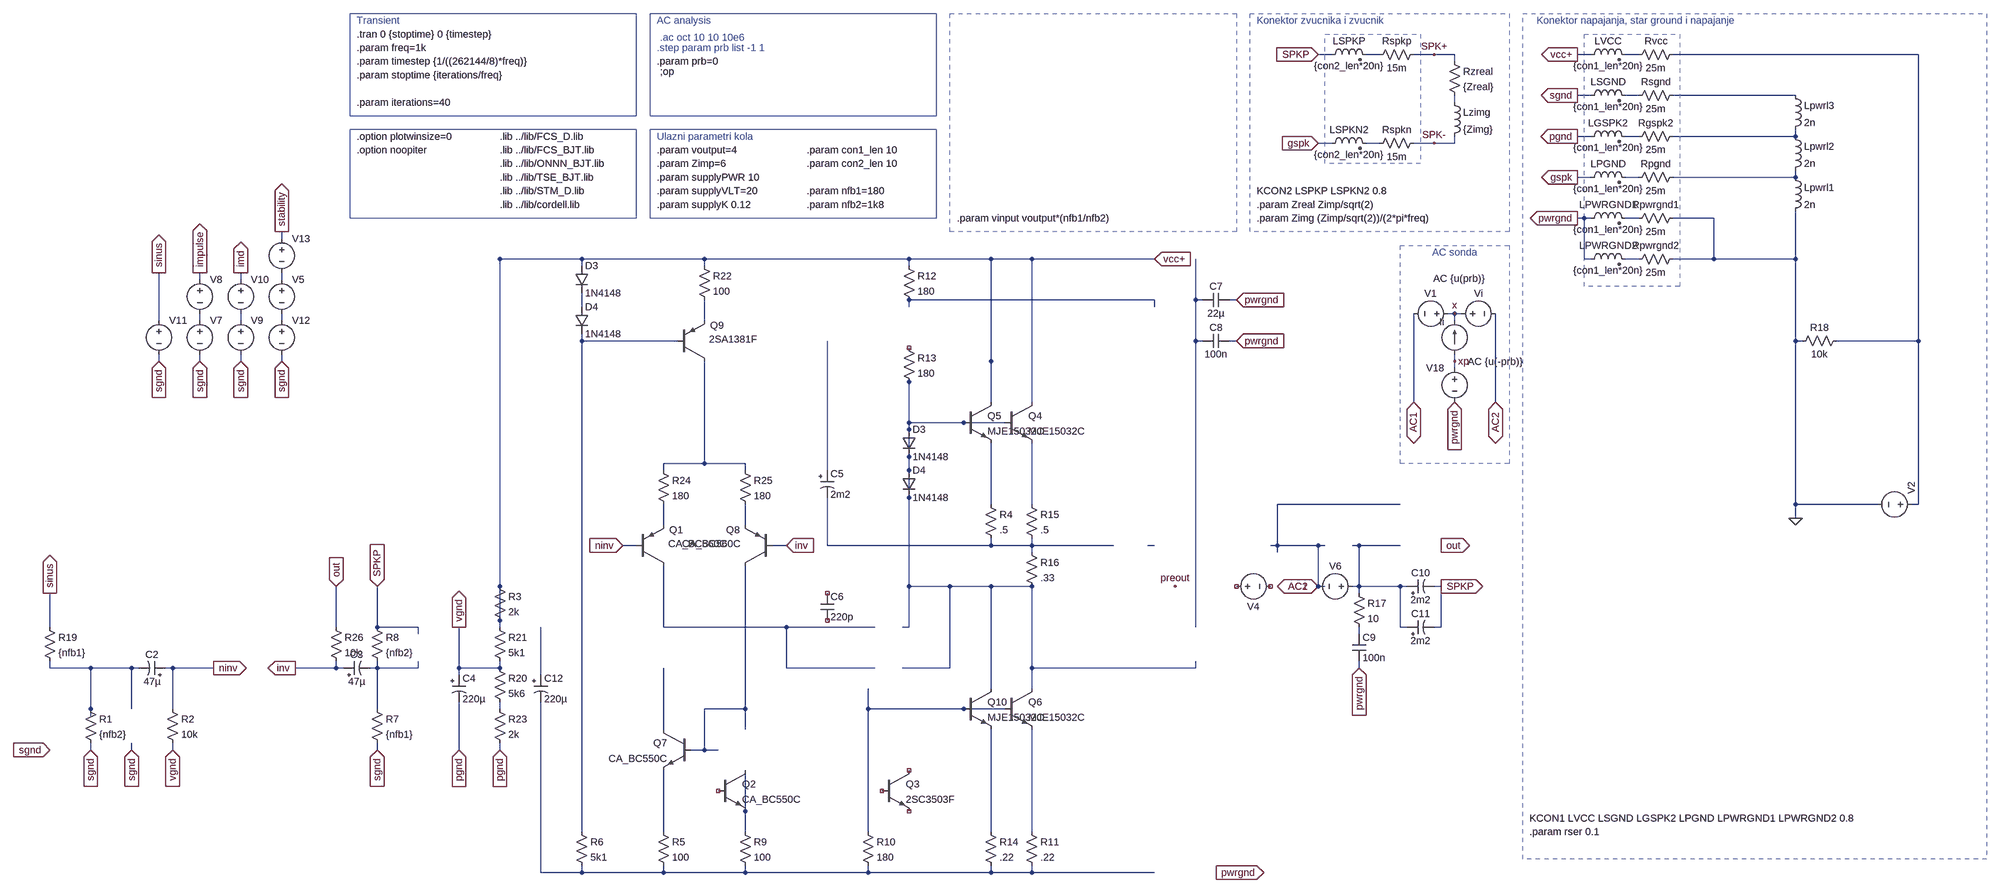
[diagram p0: schematic pa2bb-sewo.asc]
pa2bb-sewo.asc, the LTspice schematic file:
Version 4
SHEET 1 6124 2336
WIRE 2272 -1536 2240 -1536
WIRE 2384 -1536 2352 -1536
WIRE 2512 -1536 2464 -1536
WIRE 2560 -1536 2512 -1536
WIRE 2880 -1536 2848 -1536
WIRE 2992 -1536 2960 -1536
WIRE 3648 -1536 3072 -1536
WIRE 2560 -1520 2560 -1536
WIRE 2880 -1440 2848 -1440
WIRE 2992 -1440 2960 -1440
WIRE 3360 -1440 3072 -1440
WIRE 2560 -1424 2560 -1440
WIRE 2880 -1344 2848 -1344
WIRE 2992 -1344 2960 -1344
WIRE 3360 -1344 3360 -1360
WIRE 3360 -1344 3072 -1344
WIRE 2272 -1328 2240 -1328
WIRE 2384 -1328 2352 -1328
WIRE 2512 -1328 2464 -1328
WIRE 2560 -1328 2560 -1344
WIRE 2560 -1328 2512 -1328
WIRE 2880 -1248 2848 -1248
WIRE 2992 -1248 2960 -1248
WIRE 3360 -1248 3360 -1264
WIRE 3360 -1248 3072 -1248
WIRE 2864 -1152 2848 -1152
WIRE 2880 -1152 2864 -1152
WIRE 2992 -1152 2960 -1152
WIRE 3168 -1152 3072 -1152
WIRE -192 -1104 -192 -1120
WIRE 416 -1056 320 -1056
WIRE 512 -1056 416 -1056
WIRE 800 -1056 512 -1056
WIRE 1184 -1056 800 -1056
WIRE 1280 -1056 1184 -1056
WIRE 1472 -1056 1280 -1056
WIRE 1568 -1056 1472 -1056
WIRE 1760 -1056 1568 -1056
WIRE 1856 -1056 1760 -1056
WIRE 2864 -1056 2864 -1152
WIRE 2880 -1056 2864 -1056
WIRE 2992 -1056 2960 -1056
WIRE 3168 -1056 3168 -1152
WIRE 3168 -1056 3072 -1056
WIRE 3360 -1056 3360 -1168
WIRE 3360 -1056 3168 -1056
WIRE 512 -1040 512 -1056
WIRE 800 -1040 800 -1056
WIRE 1280 -1040 1280 -1056
WIRE -384 -1008 -384 -1024
WIRE -288 -1008 -288 -1024
WIRE -192 -1008 -192 -1024
WIRE 1856 -960 1280 -960
WIRE 1952 -960 1952 -1056
WIRE 1968 -960 1952 -960
WIRE 2048 -960 2032 -960
WIRE 512 -944 512 -976
WIRE 1280 -944 1280 -960
WIRE 1856 -944 1856 -960
WIRE 2560 -928 2544 -928
WIRE 2576 -928 2560 -928
WIRE -480 -912 -480 -1024
WIRE -384 -912 -384 -928
WIRE -288 -912 -288 -928
WIRE -192 -912 -192 -928
WIRE 800 -912 800 -960
WIRE 2560 -912 2560 -928
WIRE 512 -864 512 -880
WIRE 736 -864 512 -864
WIRE 1952 -864 1952 -960
WIRE 1968 -864 1952 -864
WIRE 2048 -864 2032 -864
WIRE 3360 -864 3360 -1056
WIRE 3376 -864 3360 -864
WIRE 3648 -864 3648 -1536
WIRE 3648 -864 3456 -864
WIRE -480 -816 -480 -832
WIRE -384 -816 -384 -832
WIRE -288 -816 -288 -832
WIRE -192 -816 -192 -832
WIRE 1472 -816 1472 -1056
WIRE 2560 -816 2560 -832
WIRE 2560 -800 2560 -816
WIRE 1472 -720 1472 -1056
WIRE 1568 -720 1568 -1056
WIRE 2464 -720 2464 -928
WIRE 2656 -720 2656 -928
WIRE 1280 -672 1280 -768
WIRE 1408 -672 1280 -672
WIRE 1504 -672 1408 -672
WIRE 1280 -656 1280 -672
WIRE 800 -576 800 -816
WIRE 800 -576 704 -576
WIRE 896 -576 800 -576
WIRE 704 -560 704 -576
WIRE 896 -560 896 -576
WIRE 1088 -560 1088 -864
WIRE 1280 -560 1280 -592
WIRE 1472 -480 1472 -624
WIRE 1568 -480 1568 -624
WIRE 2432 -480 2144 -480
WIRE 3360 -480 3360 -864
WIRE 3552 -480 3360 -480
WIRE 3648 -480 3648 -864
WIRE 3648 -480 3632 -480
WIRE 3360 -448 3360 -480
WIRE 704 -432 704 -480
WIRE 896 -432 896 -480
WIRE 640 -384 608 -384
WIRE 992 -384 960 -384
WIRE 1088 -384 1088 -496
WIRE 1360 -384 1088 -384
WIRE 1472 -384 1472 -400
WIRE 1472 -384 1360 -384
WIRE 1568 -384 1568 -400
WIRE 1568 -384 1472 -384
WIRE 1760 -384 1568 -384
WIRE 1856 -384 1840 -384
WIRE 2144 -384 2144 -480
WIRE 2144 -384 2128 -384
WIRE 2240 -384 2144 -384
WIRE 2256 -384 2240 -384
WIRE 2336 -384 2320 -384
WIRE 2432 -384 2336 -384
WIRE 1568 -368 1568 -384
WIRE 2144 -368 2144 -384
WIRE 320 -288 320 -1056
WIRE 1280 -288 1280 -496
WIRE 1472 -288 1280 -288
WIRE 1568 -288 1472 -288
WIRE 2240 -288 2240 -384
WIRE 2256 -288 2240 -288
WIRE 2336 -288 2336 -384
WIRE 2336 -288 2320 -288
WIRE 2432 -288 2336 -288
WIRE 2448 -288 2432 -288
WIRE 2528 -288 2512 -288
WIRE 2336 -272 2336 -288
WIRE -736 -192 -736 -272
WIRE -64 -192 -64 -288
WIRE 32 -192 32 -288
WIRE 128 -192 32 -192
WIRE 320 -192 320 -1056
WIRE 704 -192 704 -336
WIRE 992 -192 704 -192
WIRE 1200 -192 992 -192
WIRE 1280 -192 1280 -768
WIRE 1280 -192 1264 -192
WIRE 1952 -192 1952 -864
WIRE 2432 -192 2432 -288
WIRE 2448 -192 2432 -192
WIRE 2528 -192 2528 -288
WIRE 2528 -192 2512 -192
WIRE 128 -176 128 -192
WIRE 2336 -176 2336 -192
WIRE -736 -96 -736 -112
WIRE -640 -96 -736 -96
WIRE -544 -96 -640 -96
WIRE -528 -96 -544 -96
WIRE -448 -96 -464 -96
WIRE -352 -96 -448 -96
WIRE -64 -96 -64 -112
WIRE -64 -96 -160 -96
WIRE -48 -96 -64 -96
WIRE 32 -96 32 -112
WIRE 32 -96 16 -96
WIRE 128 -96 128 -112
WIRE 128 -96 32 -96
WIRE 224 -96 224 -192
WIRE 320 -96 320 -112
WIRE 320 -96 224 -96
WIRE 992 -96 992 -192
WIRE 1200 -96 992 -96
WIRE 1376 -96 1376 -288
WIRE 1376 -96 1264 -96
WIRE 1952 -96 1952 -112
WIRE 1952 -96 1568 -96
WIRE 2336 -96 2336 -112
WIRE 224 -80 224 -96
WIRE 416 -80 416 -192
WIRE 1472 -48 1472 -288
WIRE 1568 -48 1568 -288
WIRE -544 0 -544 -96
WIRE -448 0 -448 -96
WIRE 32 0 32 -96
WIRE 320 0 320 -16
WIRE 896 0 896 -336
WIRE 896 0 800 0
WIRE 1184 0 1184 -48
WIRE 1408 0 1184 0
WIRE 1504 0 1408 0
WIRE -640 16 -640 -96
WIRE 704 48 704 -96
WIRE 896 48 896 0
WIRE -640 96 -640 80
WIRE -544 96 -544 80
WIRE -448 96 -448 80
WIRE 32 96 32 80
WIRE 224 96 224 -16
WIRE 320 96 320 80
WIRE 800 96 800 0
WIRE 800 96 768 96
WIRE 832 96 800 96
WIRE 512 288 512 -864
WIRE 704 288 704 144
WIRE 896 288 896 144
WIRE 1184 288 1184 0
WIRE 1472 288 1472 48
WIRE 1568 288 1568 48
WIRE 416 384 416 -16
WIRE 512 384 512 368
WIRE 512 384 416 384
WIRE 704 384 704 368
WIRE 704 384 512 384
WIRE 896 384 896 368
WIRE 896 384 704 384
WIRE 1184 384 1184 368
WIRE 1184 384 896 384
WIRE 1472 384 1472 368
WIRE 1472 384 1184 384
WIRE 1568 384 1568 368
WIRE 1568 384 1472 384
WIRE 1856 384 1568 384
FLAG 1856 -1056 vcc+
IOPIN 1856 -1056 In
FLAG 2560 -928 x
FLAG 2528 -384 out
IOPIN 2528 -384 Out
FLAG 2560 -816 xp
FLAG 2336 -96 pwrgnd
IOPIN 2336 -96 In
FLAG -480 -816 sgnd
IOPIN -480 -816 In
FLAG -480 -1024 sinus
IOPIN -480 -1024 Out
FLAG 2848 -1536 vcc+
IOPIN 2848 -1536 Out
FLAG 2848 -1248 gspk
IOPIN 2848 -1248 Out
FLAG 2848 -1344 pgnd
IOPIN 2848 -1344 Out
FLAG 2848 -1440 sgnd
IOPIN 2848 -1440 Out
FLAG -64 -288 out
IOPIN -64 -288 In
FLAG 2528 -288 SPKP
IOPIN 2528 -288 Out
FLAG 2240 -1328 gspk
IOPIN 2240 -1328 In
FLAG 2240 -1536 SPKP
IOPIN 2240 -1536 In
FLAG 2848 -1152 pwrgnd
IOPIN 2848 -1152 Out
FLAG 3360 -448 0
FLAG 2464 -720 AC1
IOPIN 2464 -720 BiDir
FLAG 2656 -720 AC2
IOPIN 2656 -720 BiDir
FLAG 2144 -288 AC1
IOPIN 2144 -288 BiDir
FLAG 2240 -288 AC2
IOPIN 2240 -288 BiDir
FLAG 2560 -720 pwrgnd
IOPIN 2560 -720 In
FLAG 2512 -1536 SPK+
FLAG 2512 -1328 SPK-
FLAG -288 -1024 imd
IOPIN -288 -1024 Out
FLAG 2048 -864 pwrgnd
IOPIN 2048 -864 In
FLAG -384 -816 sgnd
IOPIN -384 -816 In
FLAG -288 -816 sgnd
IOPIN -288 -816 In
FLAG 1904 -288 preout
FLAG -640 96 sgnd
IOPIN -640 96 In
FLAG 2048 -960 pwrgnd
IOPIN 2048 -960 In
FLAG -192 -1120 stability
IOPIN -192 -1120 Out
FLAG -192 -816 sgnd
IOPIN -192 -816 In
FLAG 2112 384 pwrgnd
IOPIN 2112 384 In
FLAG -736 96 sgnd
IOPIN -736 96 In
FLAG 32 96 sgnd
IOPIN 32 96 In
FLAG -384 -1024 impulse
IOPIN -384 -1024 Out
FLAG 608 -384 ninv
IOPIN 608 -384 In
FLAG 32 -288 SPKP
IOPIN 32 -288 In
FLAG 224 96 pgnd
IOPIN 224 96 In
FLAG 320 96 pgnd
IOPIN 320 96 In
FLAG -448 96 vgnd
IOPIN -448 96 In
FLAG 224 -192 vgnd
IOPIN 224 -192 Out
FLAG 992 -384 inv
IOPIN 992 -384 In
FLAG -160 -96 inv
IOPIN -160 -96 Out
FLAG -352 -96 ninv
IOPIN -352 -96 Out
FLAG -544 96 sgnd
IOPIN -544 96 In
FLAG -736 -272 sinus
IOPIN -736 -272 Out
DATAFLAG 1296 -1056 ""
DATAFLAG 1760 384 ""
DATAFLAG 2016 -288 ""
SYMBOL res 16 -16 R0
SYMATTR InstName R7
SYMATTR Value {nfb1}
SYMBOL current 2560 -832 R180
WINDOW 0 24 77 Left 2
WINDOW 3 24 0 Invisible 2
WINDOW 123 -71 178 Left 2
WINDOW 39 0 0 Left 2
SYMATTR InstName Ii
SYMATTR Value 0
SYMATTR Value2 AC {u(prb)}
SYMBOL voltage 2560 -928 R270
WINDOW 0 32 56 VTop 2
WINDOW 3 -32 56 Invisible 2
WINDOW 123 -97 96 VBottom 2
WINDOW 39 -32 56 VBottom 2
SYMATTR InstName Vi
SYMATTR Value 0
SYMATTR Value2 AC {u(-prb)}
SYMBOL pnp 640 -336 M180
WINDOW 0 77 84 Left 2
WINDOW 3 75 52 Left 2
SYMATTR InstName Q1
SYMATTR Value CA_BC560C
SYMBOL res 880 272 R0
SYMATTR InstName R9
SYMATTR Value 100
SYMBOL res 16 -208 R0
SYMATTR InstName R8
SYMATTR Value {nfb2}
SYMBOL voltage 2560 -928 R90
WINDOW 0 -32 56 VBottom 2
WINDOW 3 32 56 Invisible 2
WINDOW 123 0 0 Left 2
WINDOW 39 0 0 Left 2
SYMATTR InstName V1
SYMATTR Value 0
SYMBOL res 2320 -288 R0
SYMATTR InstName R17
SYMATTR Value 10
SYMBOL res 2544 -1536 R0
SYMATTR InstName Rzreal
SYMATTR Value {Zreal}
SYMBOL ind 2544 -1440 R0
SYMATTR InstName Lzimg
SYMATTR Value {Zimg}
SYMATTR SpiceLine Cpar=10p
SYMBOL voltage 2560 -816 M0
WINDOW 123 0 0 Left 2
WINDOW 39 0 0 Left 2
WINDOW 3 24 96 Invisible 2
SYMATTR Value 0
SYMATTR InstName V18
SYMBOL cap 1968 -880 M90
WINDOW 0 0 32 VBottom 2
WINDOW 3 32 32 VTop 2
SYMATTR InstName C8
SYMATTR Value 100n
SYMATTR SpiceLine Rser=300m Lser=3n Rpar=4.4meg Cpar=1p
SYMBOL cap 2320 -176 R0
SYMATTR InstName C9
SYMATTR Value 100n
SYMATTR SpiceLine Rser=700m Lser=7n Rpar=4.4meg Cpar=1p
SYMBOL ind2 2864 -1520 R270
WINDOW 0 32 56 VTop 2
WINDOW 3 5 56 VBottom 2
SYMATTR InstName LVCC
SYMATTR Value {con1_len*20n}
SYMATTR SpiceLine Rser={con1_len*.5m}
SYMATTR Type ind
SYMBOL voltage -480 -928 R0
WINDOW 123 24 44 Left 2
WINDOW 39 0 0 Left 2
WINDOW 3 24 96 Invisible 2
SYMATTR Value SINE(0 {vinput} {freq} 0 0 0)
SYMATTR InstName V11
SYMBOL ind2 2864 -1328 R270
WINDOW 0 32 56 VTop 2
WINDOW 3 5 56 VBottom 2
SYMATTR InstName LGSPK2
SYMATTR Value {con1_len*20n}
SYMATTR SpiceLine Rser={con1_len*.5m}
SYMATTR Type ind
SYMBOL ind2 2864 -1040 R270
WINDOW 0 32 56 VTop 2
WINDOW 3 5 56 VBottom 2
SYMATTR InstName LPWRGND2
SYMATTR Value {con1_len*20n}
SYMATTR SpiceLine Rser={con1_len*.5m}
SYMATTR Type ind
SYMBOL ind2 2864 -1232 R270
WINDOW 0 32 56 VTop 2
WINDOW 3 5 56 VBottom 2
SYMATTR InstName LPGND
SYMATTR Value {con1_len*20n}
SYMATTR SpiceLine Rser={con1_len*.5m}
SYMATTR Type ind
SYMBOL ind2 2864 -1424 R270
WINDOW 0 32 56 VTop 2
WINDOW 3 5 56 VBottom 2
SYMATTR InstName LSGND
SYMATTR Value {con1_len*20n}
SYMATTR SpiceLine Rser={con1_len*.5m}
SYMATTR Type ind
SYMBOL res 3088 -1552 R90
WINDOW 0 0 56 VBottom 2
WINDOW 3 32 56 VTop 2
SYMATTR InstName Rvcc
SYMATTR Value 25m
SYMBOL res 3088 -1360 R90
WINDOW 0 0 56 VBottom 2
WINDOW 3 32 56 VTop 2
SYMATTR InstName Rgspk2
SYMATTR Value 25m
SYMBOL res 3088 -1072 R90
WINDOW 0 0 56 VBottom 2
WINDOW 3 32 56 VTop 2
SYMATTR InstName Rpwrgnd2
SYMATTR Value 25m
SYMBOL res 3088 -1264 R90
WINDOW 0 0 56 VBottom 2
WINDOW 3 32 56 VTop 2
SYMATTR InstName Rpgnd
SYMATTR Value 25m
SYMBOL res 3088 -1456 R90
WINDOW 0 0 56 VBottom 2
WINDOW 3 32 56 VTop 2
SYMATTR InstName Rsgnd
SYMATTR Value 25m
SYMBOL ind 3344 -1264 R0
SYMATTR InstName Lpwrl1
SYMATTR Value 2n
SYMATTR SpiceLine Rser=1m
SYMBOL ind 3344 -1360 R0
SYMATTR InstName Lpwrl2
SYMATTR Value 2n
SYMATTR SpiceLine Rser=1m
SYMBOL ind 3344 -1456 R0
SYMATTR InstName Lpwrl3
SYMATTR Value 2n
SYMATTR SpiceLine Rser=1m
SYMBOL ind2 2256 -1520 R270
WINDOW 0 32 56 VTop 2
WINDOW 3 5 56 VBottom 2
SYMATTR InstName LSPKP
SYMATTR Value {con2_len*20n}
SYMATTR SpiceLine Rser={con2_len*.5m}
SYMATTR Type ind
SYMBOL ind2 2256 -1312 R270
WINDOW 0 32 56 VTop 2
WINDOW 3 5 56 VBottom 2
SYMATTR InstName LSPKN2
SYMATTR Value {con2_len*20n}
SYMATTR SpiceLine Rser={con2_len*.5m}
SYMATTR Type ind
SYMBOL res 2480 -1552 R90
WINDOW 0 0 56 VBottom 2
WINDOW 3 32 56 VTop 2
SYMATTR InstName Rspkp
SYMATTR Value 15m
SYMBOL res 2480 -1344 R90
WINDOW 0 0 56 VBottom 2
WINDOW 3 32 56 VTop 2
SYMATTR InstName Rspkn
SYMATTR Value 15m
SYMBOL ind2 2864 -1136 R270
WINDOW 0 32 56 VTop 2
WINDOW 3 5 56 VBottom 2
SYMATTR InstName LPWRGND1
SYMATTR Value {con1_len*20n}
SYMATTR SpiceLine Rser={con1_len*.5m}
SYMATTR Type ind
SYMBOL res 3088 -1168 R90
WINDOW 0 0 56 VBottom 2
WINDOW 3 32 56 VTop 2
SYMATTR InstName Rpwrgnd1
SYMATTR Value 25m
SYMBOL voltage -384 -928 R0
WINDOW 3 24 96 Invisible 2
WINDOW 123 0 0 Left 2
WINDOW 39 0 0 Left 2
SYMATTR Value PULSE(0 {vinput} 1u 1n 1n {1/(freq*2)} {1/freq})
SYMATTR InstName V7
SYMBOL voltage -384 -1024 R0
WINDOW 3 24 96 Invisible 2
WINDOW 123 0 0 Left 2
WINDOW 39 0 0 Left 2
SYMATTR Value PULSE(0 {-vinput} {1u+(1/(freq*2))} 1n 1n {1/(freq*2)} {1/freq})
SYMATTR InstName V8
SYMBOL polcap -464 -80 M270
WINDOW 3 0 32 VBottom 2
WINDOW 0 32 32 VTop 2
SYMATTR Value 47µ
SYMATTR InstName C2
SYMATTR SpiceLine V=6.3 Irms=290m Rser=0.5 Lser=3n Rpar=2100k Cpar=3p
SYMATTR Description Capacitor
SYMATTR Type cap
SYMBOL voltage 2032 -288 R270
WINDOW 0 -32 56 VBottom 2
WINDOW 3 32 56 Invisible 2
WINDOW 123 0 0 Left 2
WINDOW 39 0 0 Left 2
SYMATTR InstName V4
SYMATTR Value 0
SYMBOL voltage 2336 -288 R90
WINDOW 0 -32 56 VBottom 2
WINDOW 3 32 56 Invisible 2
WINDOW 123 0 0 Left 2
WINDOW 39 0 0 Left 2
SYMATTR InstName V6
SYMATTR Value 0
SYMBOL voltage -288 -928 R0
WINDOW 3 24 96 Invisible 2
WINDOW 123 0 0 Left 2
WINDOW 39 0 0 Left 2
SYMATTR Value SINE(0 {vinput/2} 19k)
SYMATTR InstName V9
SYMBOL voltage -288 -1024 R0
WINDOW 3 24 96 Invisible 2
WINDOW 123 0 0 Left 2
WINDOW 39 0 0 Left 2
SYMATTR Value SINE(0 {vinput/2} 20k 0 0)
SYMATTR InstName V10
SYMBOL res 1552 -384 R0
SYMATTR InstName R16
SYMATTR Value .33
SYMBOL res 1552 -496 R0
SYMATTR InstName R15
SYMATTR Value .5
SYMBOL cap 1072 -272 R0
SYMATTR InstName C6
SYMATTR Value 220p
SYMATTR SpiceLine Rser=.3 Lser=6n Rpar=3.9meg Cpar=1p
SYMBOL res 3472 -880 R90
WINDOW 0 0 56 VBottom 2
WINDOW 3 32 56 VTop 2
SYMATTR InstName R18
SYMATTR Value 10k
SYMBOL cap 1968 -976 M90
WINDOW 0 0 32 VBottom 2
WINDOW 3 32 32 VTop 2
SYMATTR InstName C7
SYMATTR Value 22µ
SYMATTR SpiceLine Rser=80m Lser=6n Rpar=4.4meg Cpar=1p
SYMBOL voltage -192 -1120 R0
WINDOW 123 24 44 Left 2
WINDOW 39 0 0 Left 2
WINDOW 3 24 96 Invisible 2
SYMATTR Value SINE(0 {7*vinput/8} {freq} 0 0 0)
SYMATTR InstName V13
SYMBOL voltage -192 -1024 R0
WINDOW 3 24 96 Invisible 2
WINDOW 123 0 0 Left 2
WINDOW 39 0 0 Left 2
SYMATTR Value PULSE(0 {-vinput/8} {1u+(1/(freq*80))} 1n 1n {1/(freq*80)} {1/(freq*40)})
SYMATTR InstName V5
SYMBOL voltage -192 -928 R0
WINDOW 3 24 96 Invisible 2
WINDOW 123 0 0 Left 2
WINDOW 39 0 0 Left 2
SYMATTR Value PULSE(0 {vinput/8} 1u 1n 1n {1/(freq*80)} {1/(freq*40)})
SYMATTR InstName V12
SYMBOL res 1264 -1056 R0
SYMATTR InstName R12
SYMATTR Value 180
SYMBOL res 1168 272 R0
SYMATTR InstName R10
SYMATTR Value 180
SYMBOL voltage 3648 -480 M270
WINDOW 123 24 -12 Left 2
WINDOW 3 24 -12 Invisible 2
SYMATTR Value {supplyVLT}
SYMATTR SpiceLine Rser={rser}
SYMATTR InstName V2
SYMBOL npn 832 144 R0
SYMATTR InstName Q2
SYMATTR Value CA_BC550C
SYMBOL polcap 2448 -272 R270
WINDOW 0 32 32 VTop 2
WINDOW 3 0 32 VBottom 2
SYMATTR InstName C10
SYMATTR Value 2m2
SYMATTR SpiceLine V=6.3 Irms=1.44 Rser=0.09 Lser=5.5n Rpar=3310k Cpar=3p
SYMATTR Description Capacitor
SYMATTR Type cap
SYMBOL polcap 1072 -560 R0
SYMATTR InstName C5
SYMATTR Value 2m2
SYMATTR SpiceLine V=6.3 Irms=1.44 Rser=0.09 Lser=5.5n Rpar=3310k Cpar=3p
SYMATTR Description Capacitor
SYMATTR Type cap
SYMBOL res -464 -16 R0
SYMATTR InstName R2
SYMATTR Value 10k
SYMBOL polcap 2448 -176 R270
WINDOW 0 32 32 VTop 2
WINDOW 3 0 32 VBottom 2
SYMATTR InstName C11
SYMATTR Value 2m2
SYMATTR SpiceLine V=6.3 Irms=1.44 Rser=0.09 Lser=5.5n Rpar=3310k Cpar=3p
SYMATTR Description Capacitor
SYMATTR Type cap
SYMBOL res 304 -112 R0
SYMATTR InstName R20
SYMATTR Value 5k6
SYMBOL res 304 -208 R0
SYMATTR InstName R21
SYMATTR Value 5k1
SYMBOL polcap 208 -80 R0
SYMATTR InstName C4
SYMATTR Value 220µ
SYMATTR SpiceLine V=6.3 Irms=1.44 Rser=0.09 Lser=5.5n Rpar=3310k Cpar=3p
SYMATTR Description Capacitor
SYMATTR Type cap
SYMBOL res 304 -304 R0
SYMATTR InstName R3
SYMATTR Value 2k
SYMBOL npn 768 48 M0
SYMATTR InstName Q7
SYMATTR Value CA_BC550C
SYMBOL res 688 272 R0
SYMATTR InstName R5
SYMATTR Value 100
SYMBOL pnp 960 -336 R180
WINDOW 0 77 84 Left 2
WINDOW 3 75 52 Left 2
SYMATTR InstName Q8
SYMATTR Value CA_BC560C
SYMBOL pnp 736 -816 M180
WINDOW 0 77 84 Left 2
WINDOW 3 75 52 Left 2
SYMATTR InstName Q9
SYMATTR Value 2SA1381F
SYMBOL res 496 272 R0
SYMATTR InstName R6
SYMATTR Value 5k1
SYMBOL res 784 -1056 R0
SYMATTR InstName R22
SYMATTR Value 100
SYMBOL polcap 400 -80 R0
SYMATTR InstName C12
SYMATTR Value 220µ
SYMATTR SpiceLine V=6.3 Irms=1.44 Rser=0.09 Lser=5.5n Rpar=3310k Cpar=3p
SYMATTR Description Capacitor
SYMATTR Type cap
SYMBOL res 688 -576 R0
SYMATTR InstName R24
SYMATTR Value 180
SYMBOL res 880 -576 R0
SYMATTR InstName R25
SYMATTR Value 180
SYMBOL res -80 -208 R0
SYMATTR InstName R26
SYMATTR Value 10k
SYMBOL polcap -48 -80 R270
WINDOW 3 0 32 VBottom 2
WINDOW 0 32 32 VTop 2
SYMATTR Value 47µ
SYMATTR InstName C3
SYMATTR SpiceLine V=6.3 Irms=290m Rser=0.5 Lser=3n Rpar=2100k Cpar=3p
SYMATTR Description Capacitor
SYMATTR Type cap
SYMBOL res -656 -16 R0
SYMATTR InstName R1
SYMATTR Value {nfb2}
SYMBOL res -752 -208 R0
SYMATTR InstName R19
SYMATTR Value {nfb1}
SYMBOL diode 496 -1040 R0
SYMATTR InstName D3
SYMATTR Value 1N4148
SYMBOL diode 496 -944 R0
SYMATTR InstName D4
SYMATTR Value 1N4148
SYMBOL npn 1216 144 R0
SYMATTR InstName Q3
SYMATTR Value 2SC3503F
SYMBOL res 1264 -864 R0
SYMATTR InstName R13
SYMATTR Value 180
SYMBOL res 304 -16 R0
SYMATTR InstName R23
SYMATTR Value 2k
SYMBOL npn 1504 -720 R0
SYMATTR InstName Q4
SYMATTR Value MJE15032C
SYMBOL res 1456 -496 R0
SYMATTR InstName R4
SYMATTR Value .5
SYMBOL diode 1264 -656 R0
SYMATTR InstName D3
SYMATTR Value 1N4148
SYMBOL diode 1264 -560 R0
SYMATTR InstName D4
SYMATTR Value 1N4148
SYMBOL npn 1408 -720 R0
SYMATTR InstName Q5
SYMATTR Value MJE15032C
SYMBOL npn 1504 -48 R0
SYMATTR InstName Q6
SYMATTR Value MJE15032C
SYMBOL res 1552 272 R0
SYMATTR InstName R11
SYMATTR Value .22
SYMBOL npn 1408 -48 R0
SYMATTR InstName Q10
SYMATTR Value MJE15032C
SYMBOL res 1456 272 R0
SYMATTR InstName R14
SYMATTR Value .22
TEXT -16 -1344 Left 2 !.option plotwinsize=0
TEXT -16 -1312 Left 2 !.option noopiter
TEXT -16 -1616 Left 2 ;Transient
TEXT 688 -1520 Left 2 !.param prb=0
TEXT -16 -1520 Left 2 !.param timestep {1/((262144/8)*freq)}
TEXT -16 -1552 Left 2 !.param freq=1k
TEXT -16 -1488 Left 2 !.param stoptime {iterations/freq}
TEXT 688 -1552 Left 2 ;.step param prb list -1 1
TEXT 688 -1616 Left 2 ;AC analysis
TEXT -16 -1424 Left 2 !.param iterations=40
TEXT 320 -1280 Left 2 !.lib ../lib/ONNN_BJT.lib
TEXT 688 -1280 Left 2 !.param Zimp=6
TEXT 2096 -1184 Left 2 !.param Zreal Zimp/sqrt(2)
TEXT 2096 -1152 Left 2 !.param Zimg (Zimp/sqrt(2))/(2*pi*freq)
TEXT 688 -1248 Left 2 !.param supplyPWR 10
TEXT 688 -1216 Left 2 !.param supplyVLT=20
TEXT 320 -1216 Left 2 !.lib ../lib/STM_D.lib
TEXT 320 -1312 Left 2 !.lib ../lib/FCS_BJT.lib
TEXT 688 -1312 Left 2 !.param voutput=4
TEXT 688 -1184 Left 2 !.param supplyK 0.12
TEXT 2736 288 Left 2 !.param rser 0.1
TEXT -16 -1584 Left 2 !.tran 0 {stoptime} 0 {timestep}
TEXT 1040 -1312 Left 2 !.param con1_len 10
TEXT 2736 256 Left 2 !KCON1 LVCC LSGND LGSPK2 LPGND LPWRGND1 LPWRGND2 0.8
TEXT 1040 -1280 Left 2 !.param con2_len 10
TEXT 2096 -1216 Left 2 !KCON2 LSPKP LSPKN2 0.8
TEXT 2096 -1616 Left 2 ;Konektor zvucnika i zvucnik
TEXT 2752 -1616 Left 2 ;Konektor napajanja, star ground i napajanje
TEXT 688 -1344 Left 2 ;Ulazni parametri kola
TEXT 2560 -1072 Center 2 ;AC sonda
TEXT 320 -1344 Left 2 !.lib ../lib/FCS_D.lib
TEXT 1392 -1152 Left 2 !.param vinput voutput*(nfb1/nfb2)
TEXT 1040 -1216 Left 2 !.param nfb1=180
TEXT 1040 -1184 Left 2 !.param nfb2=1k8
TEXT 696 -1496 Left 2 !;op
TEXT 696 -1576 Left 2 ;.ac oct 10 10 10e6
TEXT 320 -1248 Left 2 !.lib ../lib/TSE_BJT.lib
TEXT 320 -1184 Left 2 !.lib ../lib/cordell.lib
RECTANGLE Normal 640 -1632 -32 -1392
RECTANGLE Normal 640 -1152 -32 -1360
RECTANGLE Normal 1344 -1632 672 -1392
RECTANGLE Normal 2688 -1120 2080 -1632 2
RECTANGLE Normal 2688 -576 2432 -1088 2
RECTANGLE Normal 3088 -992 2864 -1584 2
RECTANGLE Normal 2480 -1280 2256 -1584 2
RECTANGLE Normal 2048 -1120 1376 -1632 2
RECTANGLE Normal 1344 -1360 672 -1152
RECTANGLE Normal 3808 352 2720 -1632 2

The netlist it stands for:
* pa2bb-sewo.asc
R7 N036 sgnd {nfb1}
Ii xp x 0 AC {u(prb)}
Vi x AC2 0 AC {u(-prb)}
Q1 N033 ninv N028 0 CA_BC560C
R9 N043 N046 100
R8 SPKP N036 {nfb2}
V1 x AC1 0
R17 N032 N034 10
Rzreal SPK+ N006 {Zreal}
Lzimg N006 SPK- {Zimg} Cpar=10p
V18 xp pwrgnd 0
C8 N016 pwrgnd 100n Rser=300m Lser=3n Rpar=4.4meg Cpar=1p
C9 N034 pwrgnd 100n Rser=700m Lser=7n Rpar=4.4meg Cpar=1p
LVCC vcc+ N002 {con1_len*20n} Rser={con1_len*.5m}
V11 sinus sgnd SINE(0 {vinput} {freq} 0 0 0)
LGSPK2 pgnd N007 {con1_len*20n} Rser={con1_len*.5m}
LPWRGND2 pwrgnd N013 {con1_len*20n} Rser={con1_len*.5m}
LPGND gspk N010 {con1_len*20n} Rser={con1_len*.5m}
LSGND sgnd N004 {con1_len*20n} Rser={con1_len*.5m}
Rvcc N003 N002 25m
Rgspk2 N008 N007 25m
Rpwrgnd2 0 N013 25m
Rpgnd N011 N010 25m
Rsgnd N005 N004 25m
Lpwrl1 N011 0 2n Rser=1m
Lpwrl2 N008 N011 2n Rser=1m
Lpwrl3 N005 N008 2n Rser=1m
LSPKP SPKP N001 {con2_len*20n} Rser={con2_len*.5m}
LSPKN2 gspk N009 {con2_len*20n} Rser={con2_len*.5m}
Rspkp SPK+ N001 15m
Rspkn SPK- N009 15m
LPWRGND1 pwrgnd N012 {con1_len*20n} Rser={con1_len*.5m}
Rpwrgnd1 0 N012 25m
V7 N018 sgnd PULSE(0 {vinput} 1u 1n 1n {1/(freq*2)} {1/freq})
V8 impulse N018 PULSE(0 {-vinput} {1u+(1/(freq*2))} 1n 1n {1/(freq*2)} {1/freq})
C2 ninv N035 47µ V=6.3 Irms=290m Rser=0.5 Lser=3n Rpar=2100k Cpar=3p
V4 NC_01 NC_02 0
V6 N032 AC2 0
V9 N019 sgnd SINE(0 {vinput/2} 19k)
V10 imd N019 SINE(0 {vinput/2} 20k 0 0)
R16 N030 N023 .33
R15 N027 N030 .5
C6 NC_03 NC_04 220p Rser=.3 Lser=6n Rpar=3.9meg Cpar=1p
R18 N003 0 10k
C7 N016 pwrgnd 22µ Rser=80m Lser=6n Rpar=4.4meg Cpar=1p
V13 stability N014 SINE(0 {7*vinput/8} {freq} 0 0 0)
V5 N014 N020 PULSE(0 {-vinput/8} {1u+(1/(freq*80))} 1n 1n {1/(freq*80)} {1/(freq*40)})
V12 N020 sgnd PULSE(0 {vinput/8} 1u 1n 1n {1/(freq*80)} {1/(freq*40)})
R12 vcc+ N015 180
R10 N040 N046 180
V2 N003 0 {supplyVLT} Rser={rser}
Q2 N043 NC_05 N043 0 CA_BC550C
C10 N032 SPKP 2m2 V=6.3 Irms=1.44 Rser=0.09 Lser=5.5n Rpar=3310k Cpar=3p
C5 N025 N030 2m2 V=6.3 Irms=1.44 Rser=0.09 Lser=5.5n Rpar=3310k Cpar=3p
R2 ninv vgnd 10k
C11 N032 SPKP 2m2 V=6.3 Irms=1.44 Rser=0.09 Lser=5.5n Rpar=3310k Cpar=3p
R20 vgnd N038 5k6
R21 vcc+ vgnd 5k1
C4 vgnd pgnd 220µ V=6.3 Irms=1.44 Rser=0.09 Lser=5.5n Rpar=3310k Cpar=3p
R3 vcc+ vcc+ 2k
Q7 N041 N039 N042 0 CA_BC550C
R5 N042 N046 100
Q8 N039 inv N029 0 CA_BC560C
Q9 N024 N022 N021 0 2SA1381F
R6 N022 N046 5k1
R22 vcc+ N021 100
C12 N037 N046 220µ V=6.3 Irms=1.44 Rser=0.09 Lser=5.5n Rpar=3310k Cpar=3p
R24 N024 N028 180
R25 N024 N029 180
R26 out inv 10k
C3 inv N036 47µ V=6.3 Irms=290m Rser=0.5 Lser=3n Rpar=2100k Cpar=3p
R1 N035 sgnd {nfb2}
R19 sinus N035 {nfb1}
D3 vcc+ N017 1N4148
D4 N017 N022 1N4148
Q3 NC_06 NC_07 NC_08 0 2SC3503F
R13 NC_09 N023 180
R23 N038 pgnd 2k
Q4 vcc+ N023 N027 0 MJE15032C
R4 N026 N030 .5
D3 N023 N023 1N4148
D4 N023 N023 1N4148
Q5 vcc+ N023 N026 0 MJE15032C
Q6 N023 N040 N045 0 MJE15032C
R11 N045 N046 .22
Q10 N023 N040 N044 0 MJE15032C
R14 N044 N046 .22
.model D D
.lib standard.dio
.model NPN NPN
.model PNP PNP
.lib standard.bjt
.option plotwinsize=0
.option noopiter
* Transient
.param prb=0
.param timestep {1/((262144/8)*freq)}
.param freq=1k
.param stoptime {iterations/freq}
* .step param prb list -1 1
* AC analysis
.param iterations=40
.lib ../lib/ONNN_BJT.lib
.param Zimp=6
.param Zreal Zimp/sqrt(2)
.param Zimg (Zimp/sqrt(2))/(2*pi*freq)
.param supplyPWR 10
.param supplyVLT=20
.lib ../lib/STM_D.lib
.lib ../lib/FCS_BJT.lib
.param voutput=4
.param supplyK 0.12
.param rser 0.1
.tran 0 {stoptime} 0 {timestep}
.param con1_len 10
KCON1 LVCC LSGND LGSPK2 LPGND LPWRGND1 LPWRGND2 0.8
.param con2_len 10
KCON2 LSPKP LSPKN2 0.8
* Konektor zvucnika i zvucnik
* Konektor napajanja, star ground i napajanje
* Ulazni parametri kola
* AC sonda
.lib ../lib/FCS_D.lib
.param vinput voutput*(nfb1/nfb2)
.param nfb1=180
.param nfb2=1k8
;op
* .ac oct 10 10 10e6
.lib ../lib/TSE_BJT.lib
.lib ../lib/cordell.lib
.backanno
.end